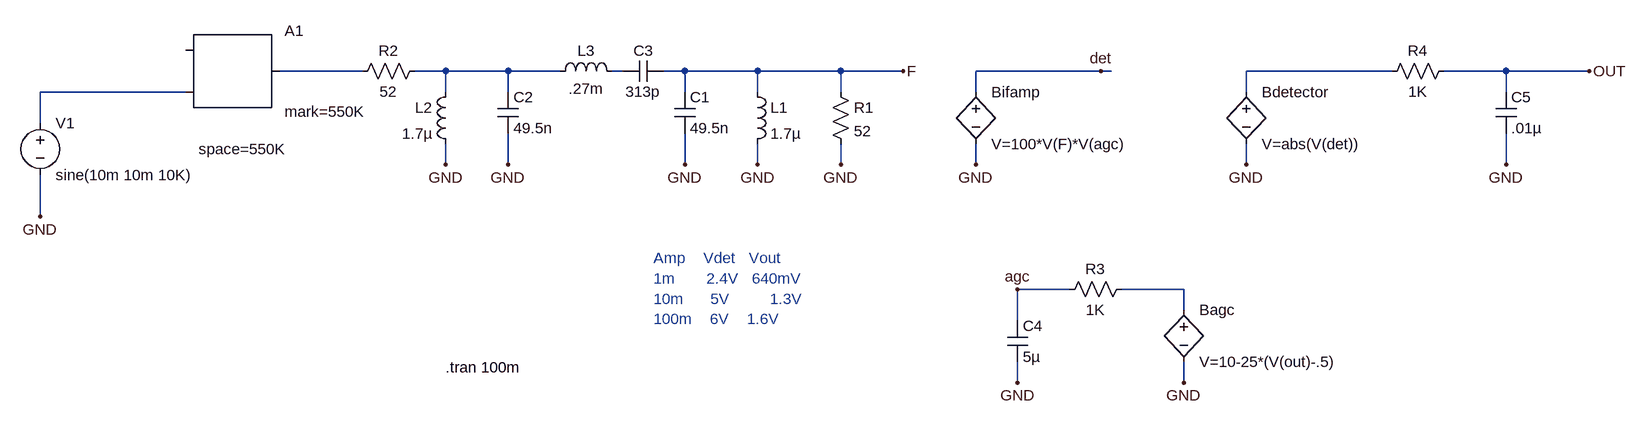
[diagram p0: schematic behave.asc]
behave.asc, the LTspice schematic file:
Version 4
SHEET 1 4092 1508
WIRE 2256 1152 2256 1120
WIRE 2256 1040 2256 1008
WIRE 2256 1008 2352 1008
WIRE 2512 1008 2528 1008
WIRE 2592 1008 2624 1008
WIRE 2736 1008 2736 1040
WIRE 2736 1120 2736 1152
WIRE 2352 1152 2352 1104
WIRE 2352 1040 2352 1008
WIRE 2352 1008 2432 1008
WIRE 2624 1008 2624 1040
WIRE 2624 1104 2624 1152
WIRE 2624 1008 2736 1008
WIRE 2736 1008 2864 1008
WIRE 2864 1008 2864 1040
WIRE 2864 1120 2864 1152
WIRE 2256 1008 2208 1008
WIRE 2128 1008 2000 1008
WIRE 3072 1152 3072 1120
WIRE 3072 1040 3072 1008
WIRE 3072 1008 3264 1008
WIRE 2864 1008 2960 1008
WIRE 3264 1008 3280 1008
WIRE 3488 1152 3488 1120
WIRE 3488 1040 3488 1008
WIRE 3488 1008 3712 1008
WIRE 3392 1488 3392 1456
WIRE 3392 1376 3392 1344
WIRE 3136 1488 3136 1456
WIRE 3136 1392 3136 1344
WIRE 3136 1344 3216 1344
WIRE 3296 1344 3392 1344
WIRE 1856 1040 1632 1040
WIRE 1632 1040 1632 1088
WIRE 1632 1168 1632 1232
WIRE 3792 1008 3888 1008
WIRE 3888 1008 3888 1040
WIRE 3888 1104 3888 1152
WIRE 3888 1008 4016 1008
FLAG 2736 1152 GND
FLAG 2624 1152 GND
FLAG 2352 1152 GND
FLAG 2256 1152 GND
FLAG 2864 1152 GND
FLAG 3072 1152 GND
FLAG 2960 1008 F
FLAG 3264 1008 det
FLAG 3488 1152 GND
FLAG 4016 1008 OUT
FLAG 3392 1488 GND
FLAG 3136 1488 GND
FLAG 3136 1344 agc
FLAG 1632 1232 GND
FLAG 3888 1152 GND
SYMBOL ind 2720 1024 R0
SYMATTR InstName L1
SYMATTR Value 1.7µ
SYMBOL cap 2608 1040 R0
SYMATTR InstName C1
SYMATTR Value 49.5n
SYMBOL cap 2336 1040 R0
SYMATTR InstName C2
SYMATTR Value 49.5n
SYMBOL ind 2272 1024 M0
SYMATTR InstName L2
SYMATTR Value 1.7µ
SYMBOL ind 2416 1024 R270
WINDOW 0 32 56 VTop 0
WINDOW 3 5 56 VBottom 0
SYMATTR InstName L3
SYMATTR Value .27m
SYMBOL cap 2592 992 R90
WINDOW 0 0 32 VBottom 0
WINDOW 3 32 32 VTop 0
SYMATTR InstName C3
SYMATTR Value 313p
SYMBOL res 2848 1024 R0
SYMATTR InstName R1
SYMATTR Value 52
SYMBOL res 2224 992 R90
WINDOW 0 0 56 VBottom 0
WINDOW 3 32 56 VTop 0
SYMATTR InstName R2
SYMATTR Value 52
SYMBOL bv 3072 1024 R0
SYMATTR InstName Bifamp
SYMATTR Value V=100*V(F)*V(agc)
SYMBOL bv 3488 1024 R0
SYMATTR InstName Bdetector
SYMATTR Value V=abs(V(det))
SYMBOL bv 3392 1360 R0
SYMATTR InstName Bagc
SYMATTR Value V=10-25*(V(out)-.5)
SYMBOL res 3312 1328 R90
WINDOW 0 0 56 VBottom 0
WINDOW 3 32 56 VTop 0
SYMATTR InstName R3
SYMATTR Value 1K
SYMBOL cap 3120 1392 R0
SYMATTR InstName C4
SYMATTR Value 5µ
SYMBOL SpecialFunctions\modulate 1856 976 R0
WINDOW 123 20 152 Left 0
SYMATTR InstName A1
SYMATTR Value mark=550K
SYMATTR Value2 space=550K
SYMBOL voltage 1632 1072 R0
SYMATTR InstName V1
SYMATTR Value sine(10m 10m 10K)
SYMBOL res 3808 992 R90
WINDOW 0 0 56 VBottom 0
WINDOW 3 32 56 VTop 0
SYMATTR InstName R4
SYMATTR Value 1K
SYMBOL cap 3872 1040 R0
SYMATTR InstName C5
SYMATTR Value .01µ
text 2256 1464 Left 0 !.tran 100m
text 2576 1296 Left 0 ;Amp    Vdet   Vout\n1m       2.4V   640mV\n10m      5V         1.3V\n100m    6V    1.6V

The netlist it stands for:
* behave.asc
L1 F GND 1.7µ
C1 F GND 49.5n
C2 N001 GND 49.5n
L2 N001 GND 1.7µ
L3 N001 N002 .27m
C3 F N002 313p
R1 F GND 52
R2 N001 N003 52
Bifamp det GND V=100*V(F)*V(agc)
Bdetector N004 GND V=abs(V(det))
Bagc N005 GND V=10-25*(V(out)-.5)
R3 N005 agc 1K
C4 agc GND 5µ
A1 0 N006 0 0 0 0 N003 0 MODULATOR mark=550K space=550K
V1 N006 GND sine(10m 10m 10K)
R4 OUT N004 1K
C5 OUT GND .01µ
.tran 100m
* Amp    Vdet   Vout
* 1m       2.4V   640mV
* 10m      5V         1.3V
* 100m    6V    1.6V
.backanno
.end